# EasyEDA schematic usb_32u4_board.json
TITLE: Sheet_1; REV: 1.0; Date: 2025-02-09; Sheet: 1/1; Company: Your Company
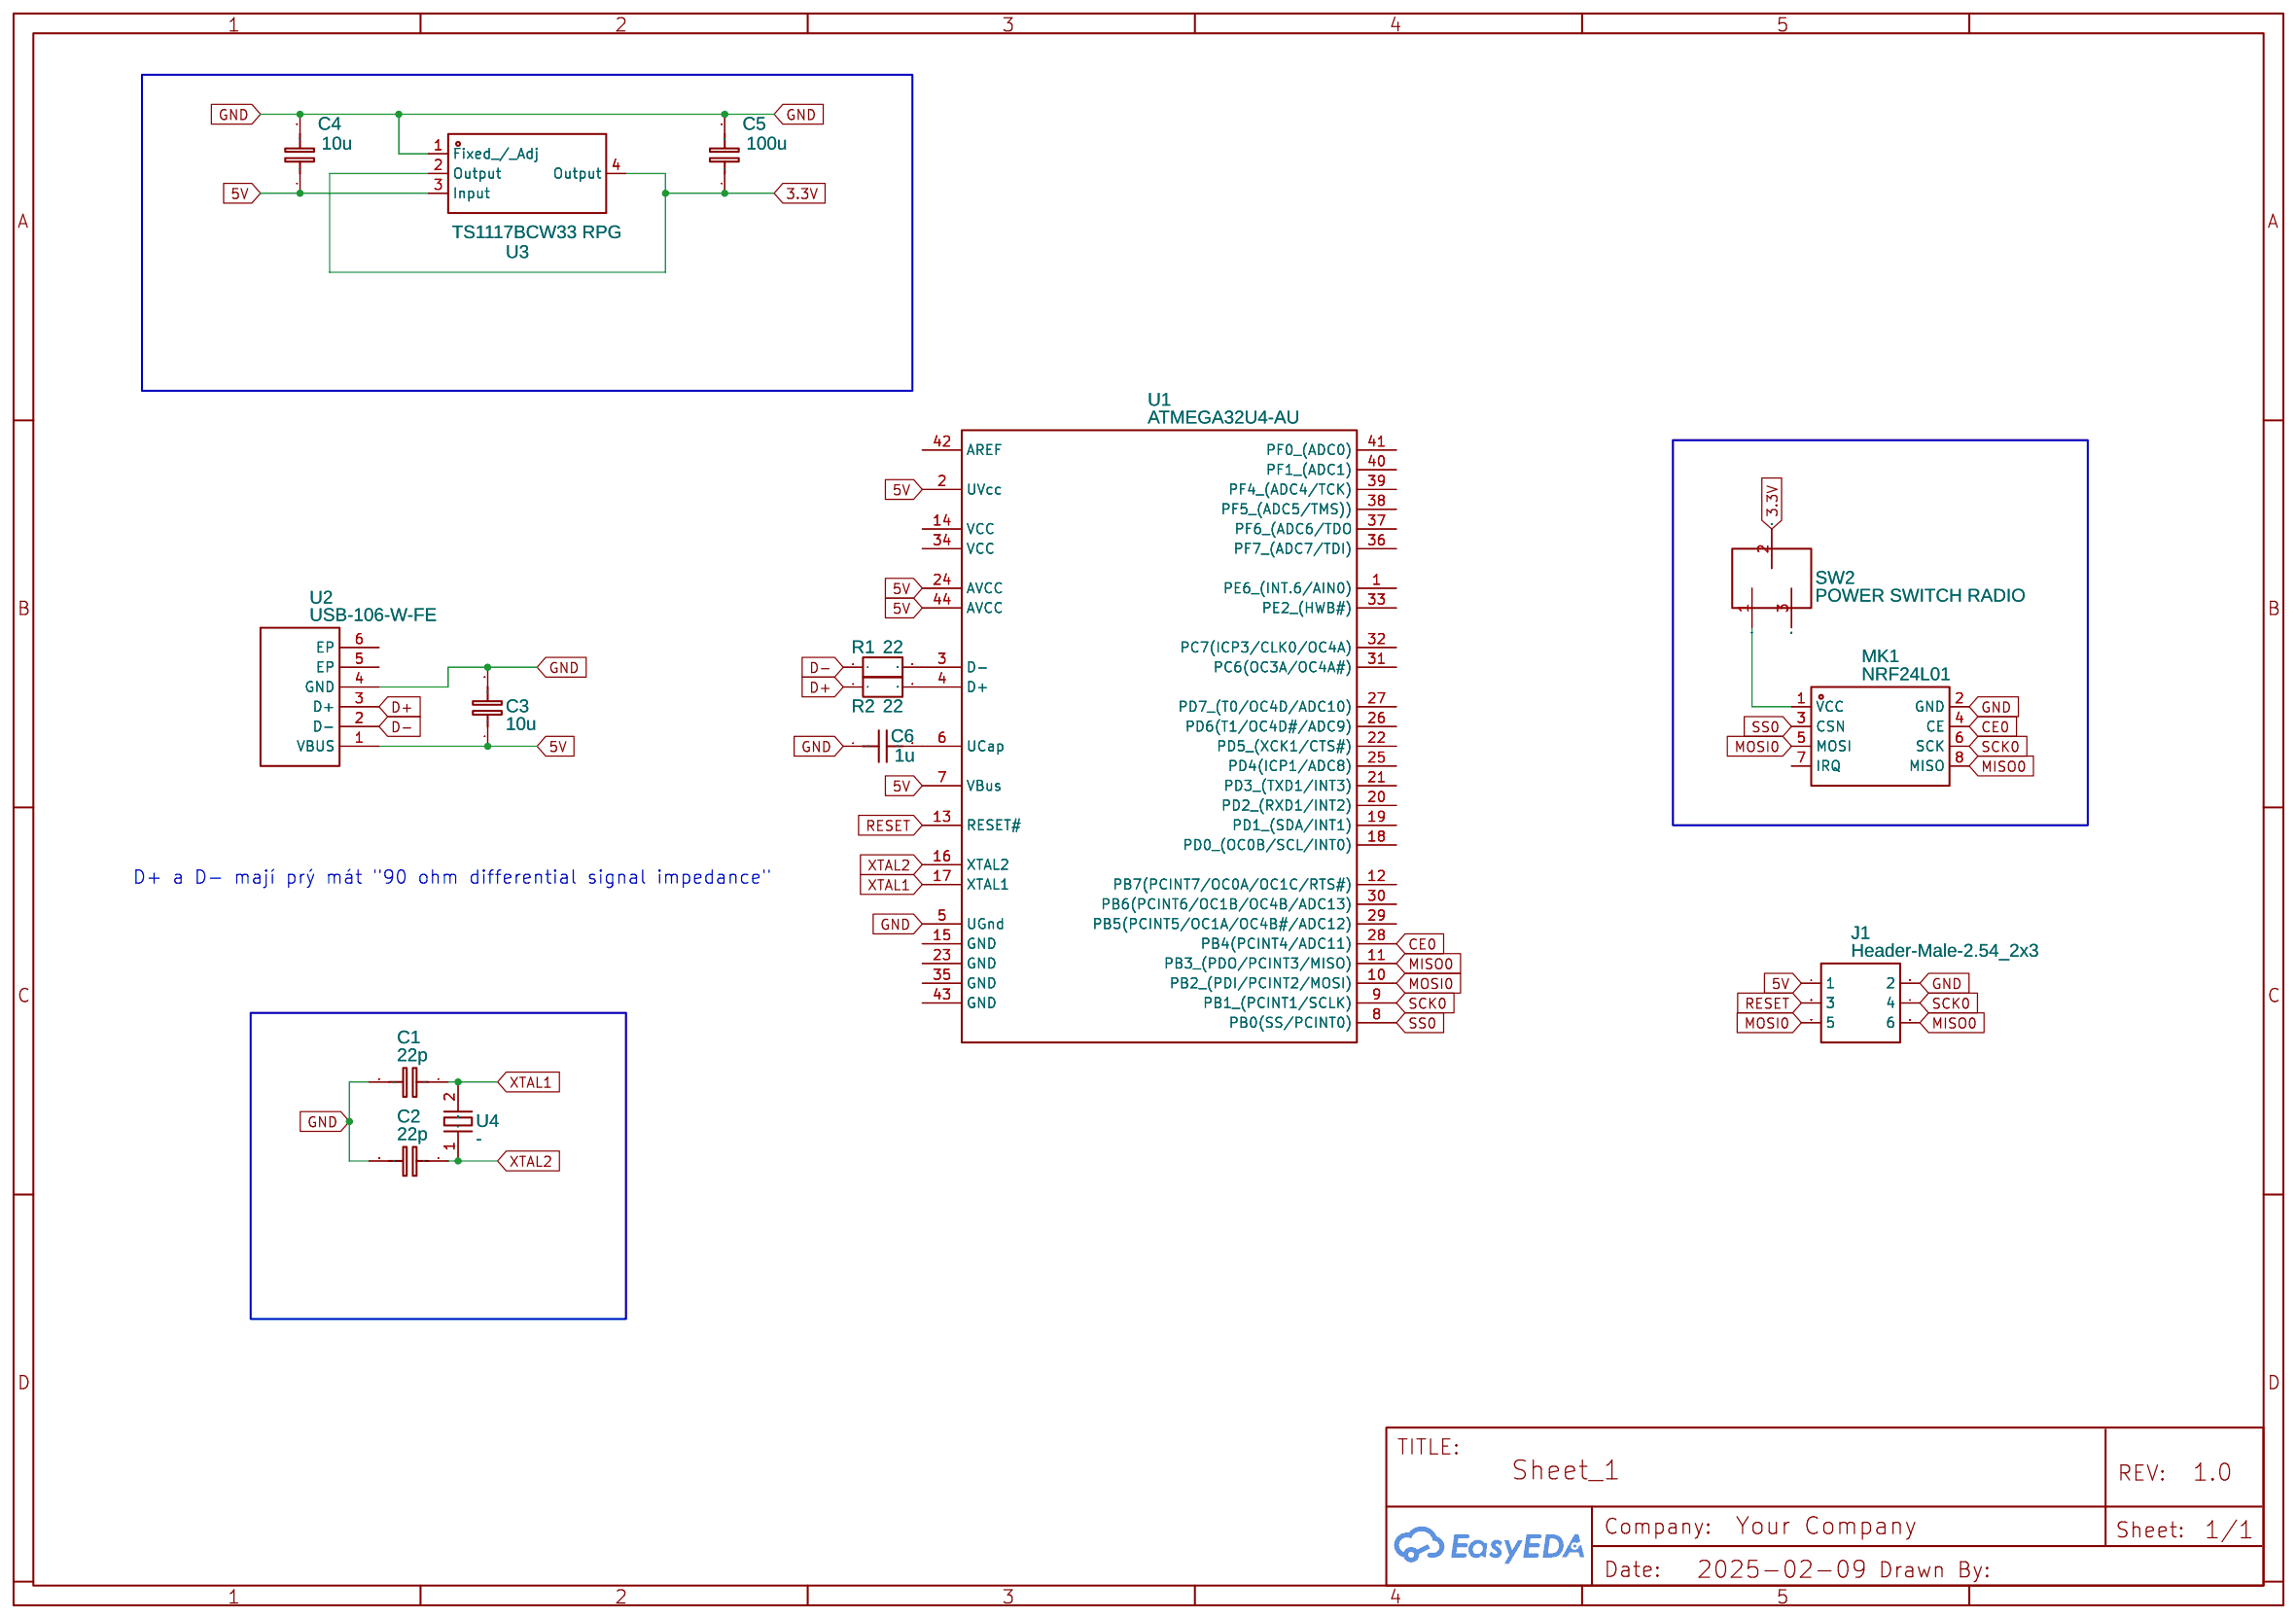
[diagram p0: schematic sheet]

## Parts
C1  22p  [C0603]
C2  22p  [C0603]
C3  10u  [C0603]
C4  10u  [C0603]
C5  100u  [C0603]
C6  1u  [C0603]
J1  Header-Male-2.54_2x3  [HDR-TH_6P-P2.54-V-M-R2-C3-S2.54-1]
MK1  NRF24L01  [WIRELM-SMD_NRF24L01]
R1  22  [R0603]
R2  22  [R0603]
SW2  POWER SWITCH RADIO  [KLS7-SS02-12F20 (1P2T)]
U1  ATMEGA32U4-AU  [QFP-44_L10.0-W10.0-P0.80-LS13.2-BL]
U2  USB-106-W-FE  [USB-A-TH_USB-106]
U3  TS1117BCW33 RPG  [SOT-223_L6.5-W3.5-P2.30-LS7.0-BR]
U4  -  [HC-49SMD_L11.1-W4.8]

## Library data of the parts
C1-C5 = C_0603_EU: Contributor: LCEDA_Lib
C6 = C_0603_US: Contributor: LCEDA_Lib
J1 = Header-Male-2.54_2x3: Supplier: LCSC; Manufacturer: BOOMELE(博穆精密); Manufacturer Part: 2.54-2*3P针; Supplier Part: C65114; JLCPCB Part Class: Extended Part
MK1 = NRF24L01: Supplier: LCSC; Manufacturer: Ai-Thinker(安信可); Manufacturer Part: NF-04; Supplier Part: C90751; JLCPCB Part Class: Extended Part
R1 R2 = R_0603_EU: Contributor: LCEDA_Lib
SW2 = DIP_SWITCH 3PIN COPY: Supplier: LCSC; Manufacturer: KE; Manufacturer Part: DIP switch 8bit,Dip Switch,DSWB03LHGET; Contributor: Роман Коваль; Supplier Part: C99420
U1 = ATMEGA32U4-AU: Supplier: LCSC; Manufacturer: MICROCHIP(美国微芯); Supplier Part: C44854; JLCPCB Part Class: Extended Part
U2 = USB-106-W-FE: Contributor: lcsc; Supplier: LCSC; Supplier Part: C2939557; Manufacturer: HOOYA(皓宇电子)
U3 = TS1117BCW33 RPG: Contributor: LCSC; Supplier: LCSC; Supplier Part: C410833; Manufacturer: Taiwan Semiconductor(台湾半导体); JLCPCB Part Class: Extended Part
U4 = CJ03-2211842020A20: Supplier: LCSC; Supplier Part: C712789; Manufacturer: CJ(江苏长电/长晶); JLCPCB Part Class: Extended Part; Contributor: lcsc

## Nets
3.3V: C5.1 SW2.2(P2) U3.2(Output) U3.4(Output)
5V: C3.1 C4.1 J1.1 U1.2(UVcc) U1.7(VBus) U1.24(AVCC) U1.44(AVCC) U2.1(VBUS) U3.3(Input)
GND: C1.2 C2.2 C3.2 C4.2 C5.2 C6.1 J1.2 MK1.2(GND) U1.5(UGnd) U2.4(GND) U3.1(Fixed / Adj)
CE0: MK1.4(CE) U1.28(PB4(PCINT4/ADC11))
D+: R2.1 U2.3(D+)
D-: R1.1 U2.2(D-)
MISO0: J1.6 MK1.8(MISO) U1.11(PB3 (PDO/PCINT3/MISO))
MOSI0: J1.5 MK1.5(MOSI) U1.10(PB2 (PDI/PCINT2/MOSI))
RESET: J1.3 U1.13(RESET#)
SCK0: J1.4 MK1.6(SCK) U1.9(PB1 (PCINT1/SCLK))
SS0: MK1.3(CSN) U1.8(PB0(SS/PCINT0))
XTAL1: C1.1 U1.17(XTAL1) U4.2(GND)
XTAL2: C2.1 U1.16(XTAL2) U4.1
Net-(C6-2): C6.2 U1.6(UCap)
Net-(R1-2): R1.2 U1.3(D-)
Net-(R2-2): R2.2 U1.4(D+)

Not connected (* = marked no-connect by the designer): MK1 1(VCC) 7(IRQ); SW2 1(P1) 3(P3); U1 1(PE6 (INT.6/AIN0)) 12(PB7(PCINT7/OC0A/OC1C/RTS#)) 14(VCC) 15(GND) 18(PD0 (OC0B/SCL/INT0)) 19(PD1 (SDA/INT1)) 20(PD2 (RXD1/INT2)) 21(PD3 (TXD1/INT3)) 22(PD5 (XCK1/CTS#)) 23(GND) 25(PD4(ICP1/ADC8)) 26(PD6(T1/OC4D#/ADC9)) 27(PD7 (T0/OC4D/ADC10)) 29(PB5(PCINT5/OC1A/OC4B#/ADC12)) 30(PB6(PCINT6/OC1B/OC4B/ADC13)) 31(PC6(OC3A/OC4A#)) 32(PC7(ICP3/CLK0/OC4A)) 33(PE2 (HWB#)) 34(VCC) 35(GND) 36(PF7 (ADC7/TDI)) 37(PF6 (ADC6/TDO) 38(PF5 (ADC5/TMS))) 39(PF4 (ADC4/TCK)) 40(PF1 (ADC1)) 41(PF0 (ADC0)) 42(AREF) 43(GND); U2 5(EP) 6(EP)

## Notes on the sheet
- D+ a D- mají prý mát "90 ohm differential signal impedance"
